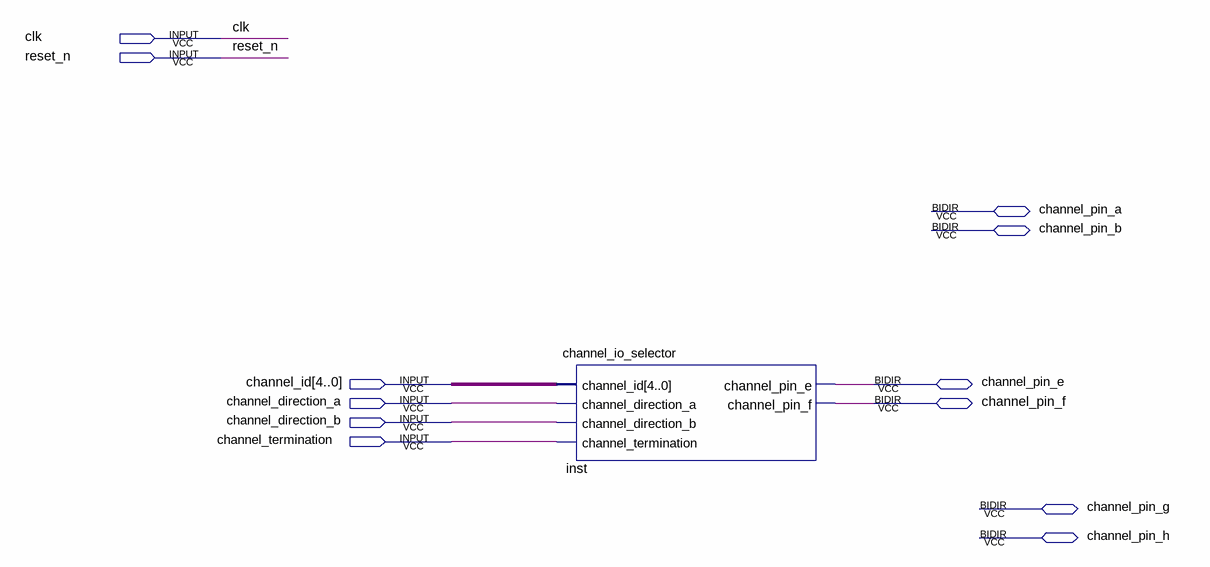
[diagram p0: schematic sheet]
// Quartus schematic channel_controller.bdf as structural Verilog: 1 symbols, 12 pins
module channel_controller (
  input  clk,
  input  reset_n,
  input  [4:0] channel_id,
  input  channel_direction_a,
  input  channel_direction_b,
  input  channel_termination,
  inout  channel_pin_a,
  inout  channel_pin_b,
  inout  channel_pin_e,
  inout  channel_pin_f,
  inout  channel_pin_g,
  inout  channel_pin_h
);

  channel_io_selector inst (
    .channel_id(channel_id), .channel_direction_a(channel_direction_a),
    .channel_direction_b(channel_direction_b), .channel_termination(channel_termination),
    .channel_pin_e(channel_pin_e), .channel_pin_f(channel_pin_f));
endmodule
